# Altium project Target Control Remote.PrjPcb
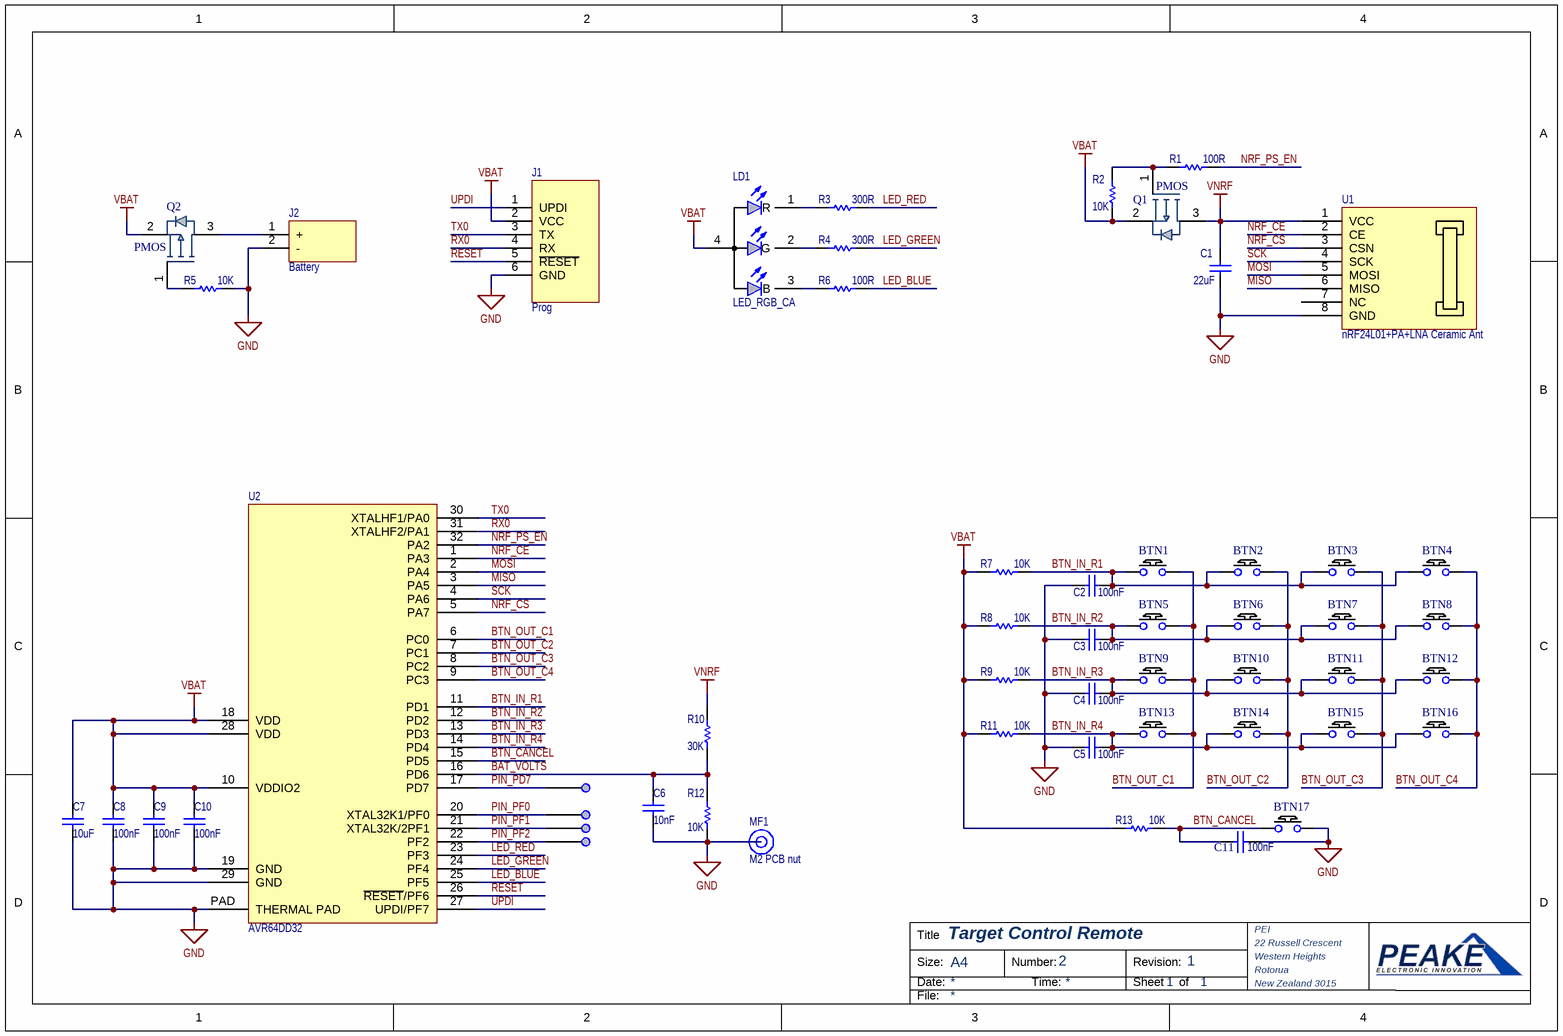
[diagram p0: Target Control Remote.SchDoc]
1 sheet, 53 parts. Net scope: global (net labels, ports and power ports of the same name join across sheets).
Board files: Target Control Remote.PcbDoc, Target Control Remote Front Panel.PcbDoc

## Sheet Target Control Remote.SchDoc: Target Control Remote
size A4; Organization: PEI; Address1: 22 Russell Crescent; Address2: Western Heights; Address3: Rotorua; Address4: New Zealand 3015; DocumentNumber: 2; Revision: 1; SheetNumber: 1; SheetTotal: 1

### Parts
BTN1  Button  [PTS526 SK15 SMTR2 LFS SMD Tactile Push Button]  (value not drawn)
BTN2  Button  [PTS526 SK15 SMTR2 LFS SMD Tactile Push Button]  (value not drawn)
BTN3  Button  [PTS526 SK15 SMTR2 LFS SMD Tactile Push Button]  (value not drawn)
BTN4  Button  [PTS526 SK15 SMTR2 LFS SMD Tactile Push Button]  (value not drawn)
BTN5  Button  [PTS526 SK15 SMTR2 LFS SMD Tactile Push Button]  (value not drawn)
BTN6  Button  [PTS526 SK15 SMTR2 LFS SMD Tactile Push Button]  (value not drawn)
BTN7  Button  [PTS526 SK15 SMTR2 LFS SMD Tactile Push Button]  (value not drawn)
BTN8  Button  [PTS526 SK15 SMTR2 LFS SMD Tactile Push Button]  (value not drawn)
BTN9  Button  [PTS526 SK15 SMTR2 LFS SMD Tactile Push Button]  (value not drawn)
BTN10  Button  [PTS526 SK15 SMTR2 LFS SMD Tactile Push Button]  (value not drawn)
BTN11  Button  [PTS526 SK15 SMTR2 LFS SMD Tactile Push Button]  (value not drawn)
BTN12  Button  [PTS526 SK15 SMTR2 LFS SMD Tactile Push Button]  (value not drawn)
BTN13  Button  [PTS526 SK15 SMTR2 LFS SMD Tactile Push Button]  (value not drawn)
BTN14  Button  [PTS526 SK15 SMTR2 LFS SMD Tactile Push Button]  (value not drawn)
BTN15  Button  [PTS526 SK15 SMTR2 LFS SMD Tactile Push Button]  (value not drawn)
BTN16  Button  [PTS526 SK15 SMTR2 LFS SMD Tactile Push Button]  (value not drawn)
BTN17  Button  [PTS526 SK15 SMTR2 LFS SMD Tactile Push Button]  (value not drawn)
C1  value 22uF  [0805_CAP]  (hidden comment: Capacitor)
C2  value 100nF  [0603_CAP]  (hidden comment: CMP-001-00172-1)
C3  value 100nF  [0603_CAP]  (hidden comment: Capacitor)
C4  value 100nF  [0603_CAP]  (hidden comment: Capacitor)
C5  value 100nF  [0603_CAP]  (hidden comment: Capacitor)
C6  value 10nF  [0603_CAP]  (hidden comment: Capacitor)
C7  value 10uF  [0603_CAP]  (hidden comment: Capacitor)
C8  value 100nF  [0603_CAP]  (hidden comment: Capacitor)
C9  value 100nF  [0603_CAP]  (hidden comment: Capacitor)
C10  value 100nF  [0603_CAP]  (hidden comment: Capacitor)
C11  value 100nF  [0603_CAP]  (hidden comment: Capacitor)
J1  Prog  [DIP6]
J2  Battery  [2mm RA S2B-PH-K-S]
J3  CMP-00044-2  [Prog Pad 1.5 x 2.5mm]  (value not drawn)
J4  CMP-00044-2  [Prog Pad 1.5 x 2.5mm]  (value not drawn)
J5  CMP-00044-2  [Prog Pad 1.5 x 2.5mm]  (value not drawn)
J6  CMP-00044-2  [Prog Pad 1.5 x 2.5mm]  (value not drawn)
LD1  LED_RGB_CA  [LED_RGB_CA]
MF1  M2 PCB nut  [PCB Nut M2-TH]
Q1  PMOS  [SOT-23-PMOS]
Q2  PMOS  [SOT-23-PMOS]
R1  value 100R  [0603_RES]  (hidden comment: Resistor)
R2  value 10K  [0603_RES]  (hidden comment: Resistor)
R3  value 300R  [0603_RES]  (hidden comment: Resistor)
R4  value 300R  [0603_RES]  (hidden comment: Resistor)
R5  value 10K  [0603_RES]  (hidden comment: Resistor)
R6  value 100R  [0603_RES]  (hidden comment: Resistor)
R7  value 10K  [0603_RES]  (hidden comment: Resistor)
R8  value 10K  [0603_RES]  (hidden comment: Resistor)
R9  value 10K  [0603_RES]  (hidden comment: Resistor)
R10  value 30K  [0603_RES]  (hidden comment: Resistor)
R11  value 10K  [0603_RES]  (hidden comment: Resistor)
R12  value 10K  [0603_RES]  (hidden comment: Resistor)
R13  value 10K  [0603_RES]  (hidden comment: Resistor)
U1  nRF24L01+PA+LNA Ceramic Ant  [nRF24L01+PA+LNA Ceramic Antenna-Footprint-1]
U2  AVR64DD32  [32P VQFN]

### Nets
GND: BTN17.2 C1.1 C2.2 C3.2 C4.2 C5.2 C6.1 C7.1 C8.1 C9.1 C10.1 C11.1 J1.6(GND) J2.2(-) MF1.1 R5.2 R12.1 U1.8(GND) U2.19(GND) U2.29(GND) U2.PAD(THERMAL_PAD)
VBAT: C7.2 C8.2 C9.2 C10.2 J1.2(VCC) LD1.4(A) Q1.2(S) Q2.2(S) R2.1 R7.1 R8.1 R9.1 R11.1 R13.1 U2.10(VDDIO2) U2.18(VDD) U2.28(VDD)
VNRF: C1.2 Q1.3(D) R10.2 U1.1(VCC)
BAT_VOLTS: C6.2 R10.1 R12.2 U2.16(PD6)
BTN_CANCEL: BTN17.1 C11.2 R13.2 U2.15(PD5)
BTN_IN_R1: BTN1.1 BTN2.1 BTN3.1 BTN4.1 C2.1 R7.2 U2.11(PD1)
BTN_IN_R2: BTN5.1 BTN6.1 BTN7.1 BTN8.1 C3.1 R8.2 U2.12(PD2)
BTN_IN_R3: BTN9.1 BTN10.1 BTN11.1 BTN12.1 C4.1 R9.2 U2.13(PD3)
BTN_IN_R4: BTN13.1 BTN14.1 BTN15.1 BTN16.1 C5.1 R11.2 U2.14(PD4)
BTN_OUT_C1: BTN1.2 BTN5.2 BTN9.2 BTN13.2 U2.6(PC0)
BTN_OUT_C2: BTN2.2 BTN6.2 BTN10.2 BTN14.2 U2.7(PC1)
BTN_OUT_C3: BTN3.2 BTN7.2 BTN11.2 BTN15.2 U2.8(PC2)
BTN_OUT_C4: BTN4.2 BTN8.2 BTN12.2 BTN16.2 U2.9(PC3)
LED_BLUE: R6.2 U2.25(PF5)
LED_GREEN: R4.2 U2.24(PF4)
LED_RED: R3.2 U2.23(PF3)
MISO: U1.6(MISO) U2.3(PA5)
MOSI: U1.5(MOSI) U2.2(PA4)
NRF_CE: U1.2(CE) U2.1(PA3)
NRF_CS: U1.3(CSN) U2.5(PA7)
NRF_PS_EN: R1.2 U2.32(PA2)
PIN_PD7: J3.1 U2.17(PD7)
PIN_PF0: J4.1 U2.20(XTAL32K1/PF0)
PIN_PF1: J5.1 U2.21(XTAL32K/2PF1)
PIN_PF2: J6.1 U2.22(PF2)
~{RESET}: J1.5(~{RESET}) U2.26(~{RESET}/PF6)
RX0: J1.4(RX) U2.31(XTALHF2/PA1)
SCK: U1.4(SCK) U2.4(PA6)
TX0: J1.3(TX) U2.30(XTALHF1/PA0)
UPDI: J1.1(UPDI) U2.27(UPDI/PF7)
NetJ2_1: J2.1(+) Q2.3(D)
NetLD1_1: LD1.1(R) R3.1
NetLD1_2: LD1.2(G) R4.1
NetLD1_3: LD1.3(B) R6.1
NetQ1_1: Q1.1(G) R1.1 R2.2
NetQ2_1: Q2.1(G) R5.1

Not connected (* = marked no-connect by the designer): U1 7(NC)

### Notes on the sheet
- Title
- Size:
- Date:
- A4
- Number:
- Time:
- Revision:
- Sheet
- of
- File:

### Library data of the parts
BTN1-BTN17 = CMP-079-000142-1: Momentary push button; Pins: 2; Source: Discrete.SchLib; Component Type: Standard; Design Item ID: Button; Pin Count: 2
C1-C11 = CMP-001-00172-1: SMD Capacitor; Pins: 2; Source: Discrete.SchLib; Component Type: Standard; Design Item ID: Capacitor
J1 = CMP-002-00180-1: 6 Pin Connector; Component Type: Standard; Design Item ID: 6_Pin; Pins: 6; Source: Connectors.SchLib; Pin Count: 6
J2 = CMP-002-00173-1: 2 Pin Connector; MFN: *; Source: Connectors.SchLib; Component Type: Standard; Pins: 2; Design Item ID: 2_Pin; Pin Count: 2
J3-J6 = CMP-079-000036-1: Programmer pogo-pin interface pad (or test pad); Source: All Components - 30.06.23 - 18.27.SchLib; Component Type: Standard; Pin Count: 1; Design Item ID: CMP-00044-2
LD1 = CMP-007-00085-1: Common Annode SMD RGB LED; Design Item ID: LED_RGB_CA; Source: Discrete.SchLib; Component Type: Standard; Pins: 4
MF1 = CMP-014-000014-1: SMD or through hole soldered PCB nut; Thread: M2 x 0.4; MFN: SMTWE2035MTJ; Design Item ID: CMP-00059-2; Length: 4.9mm; Component Type: Standard; Pin Count: 1; Source: All Components - 30.06.23 - 18.27.SchLib; Mount style: SMD
Q1 Q2 = CMP-079-000100-1: P Channel MOSFET; MFN: BSS308PE; Source: P-MOS.SchLib; Component Type: Standard; Design Item ID: PMOS; Pin Count: 3
R1-R13 = CMP-009-00356-1: SMD Resistor; Component Type: Standard; Design Item ID: Resistor; Pins: 2; Source: Discrete.SchLib
U1 = CMP-082-000000-1: nRF24L01+PA+LNA Ceramic Antenna SMD module YJ-13039; Design Item ID: CMP-00025-00003-2; Source: nRF24L01_Ceramic.SchLib
U2 = CMP-031-00048-1: AVR DD series 24MHz 8-bit 32 pin MCU 1.8-5.5V, multi voltage, 27 GPIO, 64K flash, 8K SRAM, 256b EEPROM.; Pin Count: 33; Source: All Components - 30.06.23 - 18.27.SchLib; Component Type: Standard; Design Item ID: CMP-00041-1